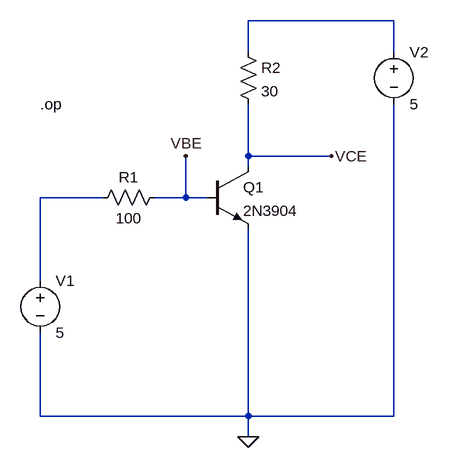
[diagram p0: schematic BJTSimu.asc]
BJTSimu.asc, the LTspice schematic file:
Version 4
SHEET 1 892 680
WIRE 736 -80 512 -80
WIRE 512 -32 512 -80
WIRE 736 -32 736 -80
WIRE 512 128 512 48
WIRE 640 128 512 128
WIRE 512 144 512 128
WIRE 288 192 192 192
WIRE 416 192 416 128
WIRE 416 192 368 192
WIRE 448 192 416 192
WIRE 192 320 192 192
WIRE 192 528 192 400
WIRE 512 528 512 240
WIRE 512 528 192 528
WIRE 736 528 736 48
WIRE 736 528 512 528
WIRE 512 560 512 528
FLAG 512 560 0
FLAG 416 128 VBE
FLAG 640 128 VCE
SYMBOL voltage 192 304 R0
SYMATTR InstName V1
SYMATTR Value 5
SYMBOL voltage 736 -48 R0
SYMATTR InstName V2
SYMATTR Value 5
SYMBOL npn 448 144 R0
SYMATTR InstName Q1
SYMATTR Value 2N3904
SYMBOL res 272 208 R270
WINDOW 0 32 56 VTop 2
WINDOW 3 0 56 VBottom 2
SYMATTR InstName R1
SYMATTR Value 100
SYMBOL res 496 -48 R0
SYMATTR InstName R2
SYMATTR Value 30
TEXT 192 48 Left 2 !.op

The netlist it stands for:
* BJTSimu.asc
V1 N002 0 5
V2 N001 0 5
Q1 VCE VBE 0 0 2N3904
R1 N002 VBE 100
R2 N001 VCE 30
.model NPN NPN
.model PNP PNP
.lib standard.bjt
.op
.backanno
.end